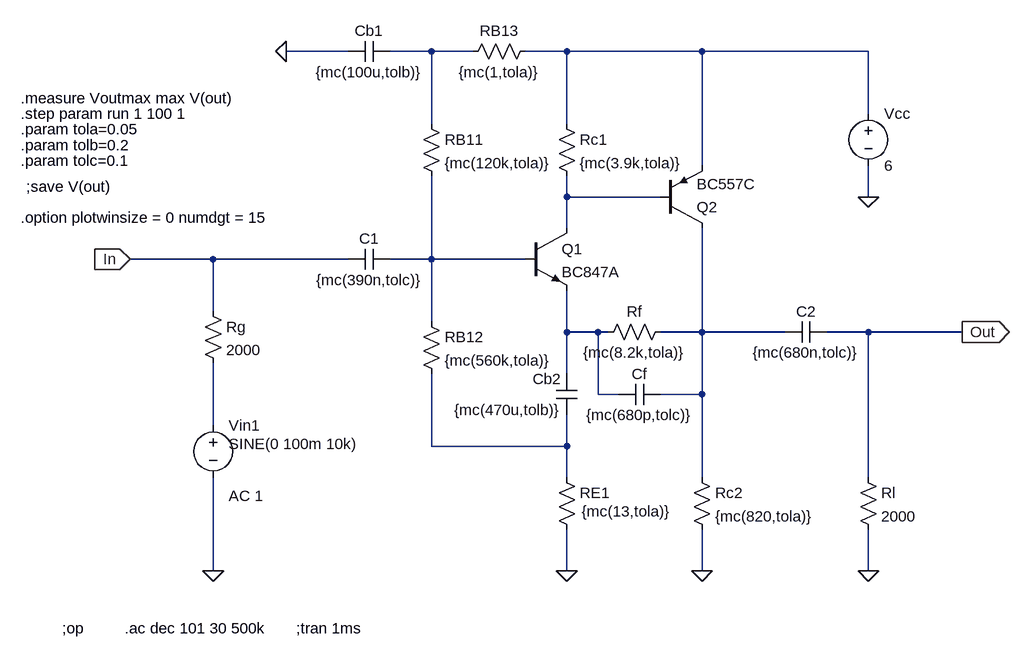
[diagram p0: schematic Monte Carlo.asc]
Monte Carlo.asc, the LTspice schematic file:
Version 4
SHEET 1 1192 712
WIRE -256 -368 -352 -368
WIRE -128 -368 -192 -368
WIRE -64 -368 -128 -368
WIRE 80 -368 16 -368
WIRE 288 -368 80 -368
WIRE 544 -368 288 -368
WIRE 544 -272 544 -368
WIRE -128 -256 -128 -368
WIRE 80 -256 80 -368
WIRE 288 -192 288 -368
WIRE 80 -144 80 -176
WIRE 224 -144 80 -144
WIRE 544 -144 544 -192
WIRE 80 -96 80 -144
WIRE -464 -48 -592 -48
WIRE -256 -48 -464 -48
WIRE -128 -48 -128 -176
WIRE -128 -48 -192 -48
WIRE 16 -48 -128 -48
WIRE -464 32 -464 -48
WIRE -128 48 -128 -48
WIRE 80 64 80 0
WIRE 128 64 80 64
WIRE 144 64 128 64
WIRE 288 64 288 -96
WIRE 288 64 224 64
WIRE 416 64 288 64
WIRE 544 64 480 64
WIRE 688 64 544 64
WIRE 80 128 80 64
WIRE 128 160 128 64
WIRE 160 160 128 160
WIRE 288 160 288 64
WIRE 288 160 224 160
WIRE -464 208 -464 112
WIRE -128 240 -128 128
WIRE 80 240 80 192
WIRE 80 240 -128 240
WIRE 80 288 80 240
WIRE 288 288 288 160
WIRE 544 288 544 64
WIRE -464 432 -464 288
WIRE 80 432 80 368
WIRE 288 432 288 368
WIRE 544 432 544 368
FLAG -352 -368 0
FLAG 544 -144 0
FLAG 688 64 Out
IOPIN 688 64 Out
FLAG -592 -48 In
IOPIN -592 -48 In
FLAG -464 432 0
FLAG 80 432 0
FLAG 288 432 0
FLAG 544 432 0
SYMBOL res 32 -384 R90
WINDOW 0 0 56 VBottom 2
WINDOW 3 32 56 VTop 2
SYMATTR InstName RB13
SYMATTR Value {mc(1,tola)}
SYMBOL res -144 -272 R0
SYMATTR InstName RB11
SYMATTR Value {mc(120k,tola)}
SYMBOL res -144 32 R0
SYMATTR InstName RB12
SYMATTR Value {mc(560k,tola)}
SYMBOL res 64 272 R0
WINDOW 3 39 68 Left 2
SYMATTR Value {mc(13,tola)}
SYMATTR InstName RE1
SYMBOL res 240 48 R90
WINDOW 0 0 56 VBottom 2
WINDOW 3 32 56 VTop 2
SYMATTR InstName Rf
SYMATTR Value {mc(8.2k,tola)}
SYMBOL res 272 272 R0
SYMATTR InstName Rc2
SYMATTR Value {mc(820,tola)}
SYMBOL voltage 544 -288 R0
WINDOW 123 0 0 Left 0
WINDOW 39 0 0 Left 0
SYMATTR InstName Vcc
SYMATTR Value 6
SYMBOL npn 16 -96 R0
SYMATTR InstName Q1
SYMATTR Value BC847A
SYMBOL pnp 224 -96 M180
SYMATTR InstName Q2
SYMATTR Value BC557C
SYMBOL res 64 -272 R0
SYMATTR InstName Rc1
SYMATTR Value {mc(3.9k,tola)}
SYMBOL cap 224 144 R90
WINDOW 0 0 32 VBottom 2
WINDOW 3 32 32 VTop 2
SYMATTR InstName Cf
SYMATTR Value {mc(680p,tolc)}
SYMBOL cap -192 -64 R90
WINDOW 0 0 32 VBottom 2
WINDOW 3 32 32 VTop 2
SYMATTR InstName C1
SYMATTR Value {mc(390n,tolc)}
SYMBOL cap 96 192 R180
WINDOW 0 24 56 Left 2
WINDOW 3 24 8 Left 2
SYMATTR InstName Cb2
SYMATTR Value {mc(470u,tolb)}
SYMBOL cap -256 -352 R270
WINDOW 0 32 32 VTop 2
WINDOW 3 0 32 VBottom 2
SYMATTR InstName Cb1
SYMATTR Value {mc(100u,tolb)}
SYMBOL cap 416 80 R270
WINDOW 0 32 32 VTop 2
WINDOW 3 0 32 VBottom 2
SYMATTR InstName C2
SYMATTR Value {mc(680n,tolc)}
SYMBOL res -480 16 R0
SYMATTR InstName Rg
SYMATTR Value 2000
SYMBOL res 528 272 R0
SYMATTR InstName Rl
SYMATTR Value 2000
SYMBOL voltage -464 192 R0
WINDOW 123 24 124 Left 2
WINDOW 39 0 0 Left 0
WINDOW 3 24 44 Left 2
SYMATTR Value2 AC 1
SYMATTR Value SINE(0 100m 10k)
SYMATTR InstName Vin1
TEXT -696 520 Left 2 !;op
TEXT -600 520 Left 2 !.ac dec 101 30 500k
TEXT -336 520 Left 2 !;tran 1ms
TEXT -760 -248 Left 2 !.param tola=0.05
TEXT -760 -272 Left 2 !.step param run 1 100 1
TEXT -760 -296 Left 2 !.measure Voutmax max V(out)
TEXT -760 -224 Left 2 !.param tolb=0.2
TEXT -760 -200 Left 2 !.param tolc=0.1
TEXT -752 -160 Left 2 !;save V(out)
TEXT -760 -112 Left 2 !.option plotwinsize = 0 numdgt = 15

The netlist it stands for:
* Monte Carlo.asc
RB13 N002 N001 {mc(1,tola)}
RB11 N001 N004 {mc(120k,tola)}
RB12 N004 N008 {mc(560k,tola)}
RE1 N008 0 {mc(13,tola)}
Rf N006 N005 {mc(8.2k,tola)}
Rc2 N006 0 {mc(820,tola)}
Vcc N002 0 6
Q1 N003 N004 N005 0 BC847A
Q2 N006 N003 N002 0 BC557C
Rc1 N002 N003 {mc(3.9k,tola)}
Cf N006 N005 {mc(680p,tolc)}
C1 N004 In {mc(390n,tolc)}
Cb2 N008 N005 {mc(470u,tolb)}
Cb1 0 N001 {mc(100u,tolb)}
C2 N006 Out {mc(680n,tolc)}
Rg In N007 2000
Rl Out 0 2000
Vin1 N007 0 SINE(0 100m 10k) AC 1
.model NPN NPN
.model PNP PNP
.lib standard.bjt
;op
.ac dec 101 30 500k
;tran 1ms
.param tola=0.05
.step param run 1 100 1
.measure Voutmax max V(out)
.param tolb=0.2
.param tolc=0.1
;save V(out)
.option plotwinsize = 0 numdgt = 15
.backanno
.end